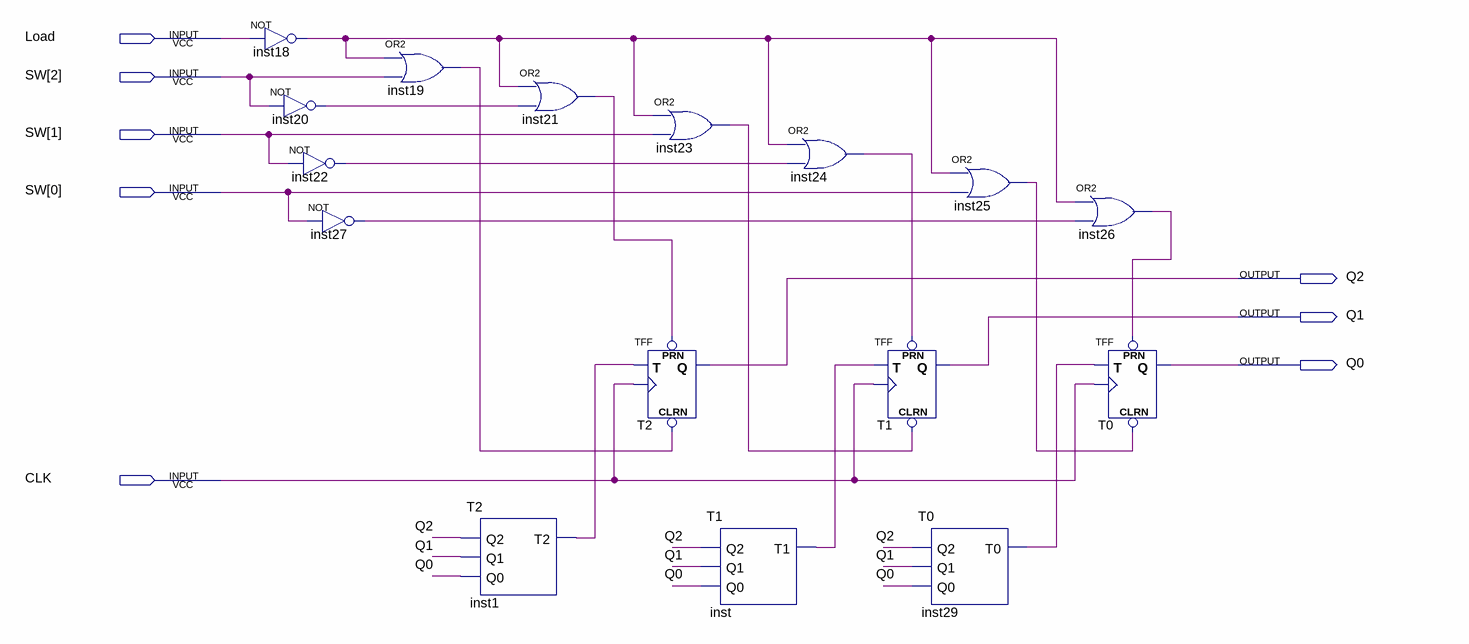
[diagram p0: schematic sheet]
// Quartus schematic MainDesign.bdf as structural Verilog: 16 symbols, 8 pins
module MainDesign (
  input  Load,
  input  [2:0] SW,
  input  CLK,
  output Q2,
  output Q1,
  output Q0
);

  wire inst1_t2, inst18_out, inst19_out, inst20_out, inst21_out, inst22_out, inst23_out, inst24_out,
       inst25_out, inst26_out, inst27_out, inst29_t0, inst_t1;

  not inst18 (inst18_out, Load);
  not inst20 (inst20_out, SW[2]);
  not inst22 (inst22_out, SW[1]);
  not inst27 (inst27_out, SW[0]);
  or inst19 (inst19_out, inst18_out, SW[2]);
  T2 inst1 (.Q2(Q2), .Q1(Q1), .Q0(Q0), .T2(inst1_t2));
  or inst21 (inst21_out, inst18_out, inst20_out);
  or inst23 (inst23_out, inst18_out, SW[1]);
  TFF T2 (.PRN(inst21_out), .CLRN(inst19_out), .T(inst1_t2), .CLK(CLK), .Q(Q2));
  T1 inst (.Q2(Q2), .Q1(Q1), .Q0(Q0), .T1(inst_t1));
  or inst24 (inst24_out, inst18_out, inst22_out);
  TFF T1 (.PRN(inst24_out), .CLRN(inst23_out), .T(inst_t1), .CLK(CLK), .Q(Q1));
  T0 inst29 (.Q2(Q2), .Q1(Q1), .Q0(Q0), .T0(inst29_t0));
  or inst25 (inst25_out, inst18_out, SW[0]);
  or inst26 (inst26_out, inst18_out, inst27_out);
  TFF T0 (.PRN(inst26_out), .CLRN(inst25_out), .T(inst29_t0), .CLK(CLK), .Q(Q0));
endmodule
